# Altium schematic sheet ESC.SchDoc
size A2; SheetNumber: 1; SheetTotal: 1
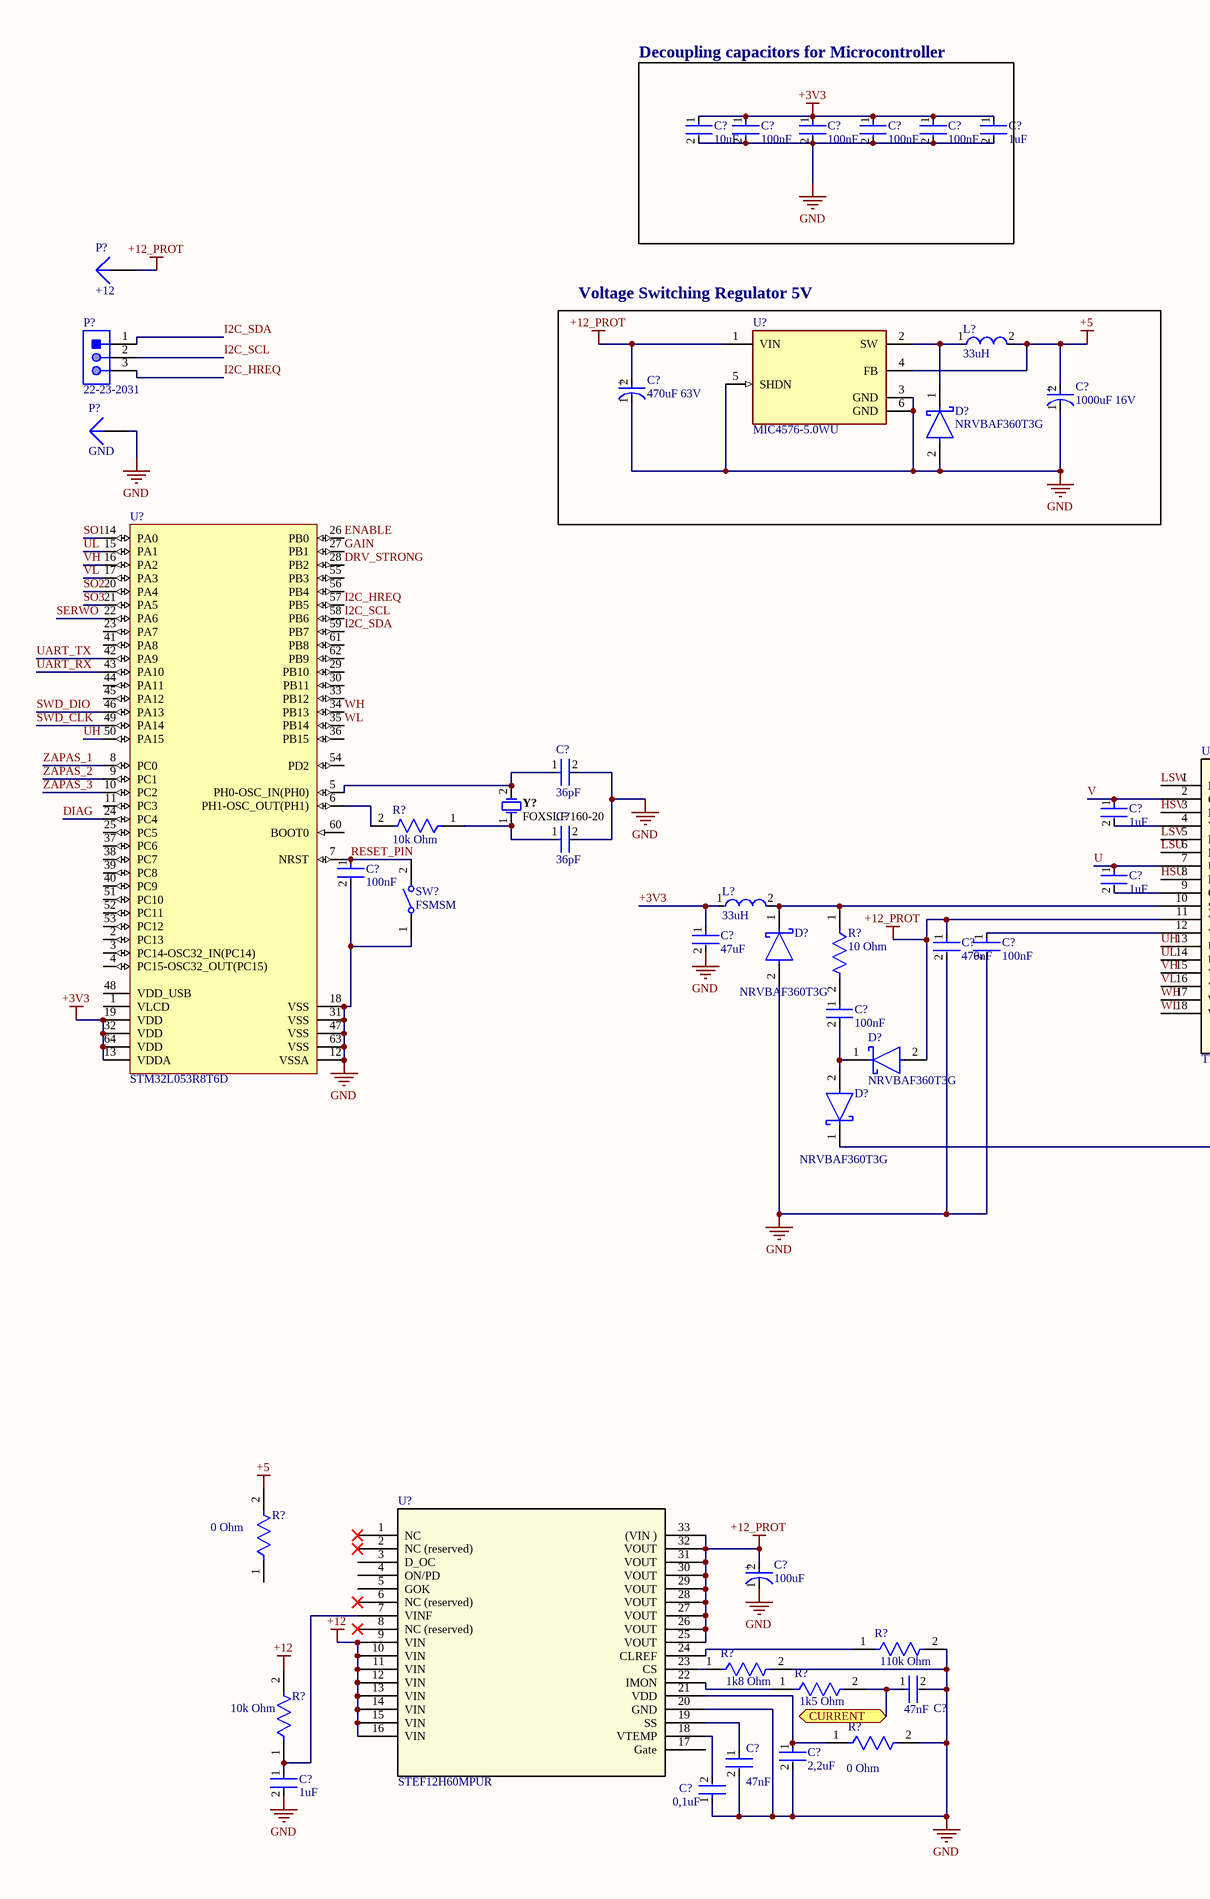
[diagram p0: ESC.SchDoc, left]
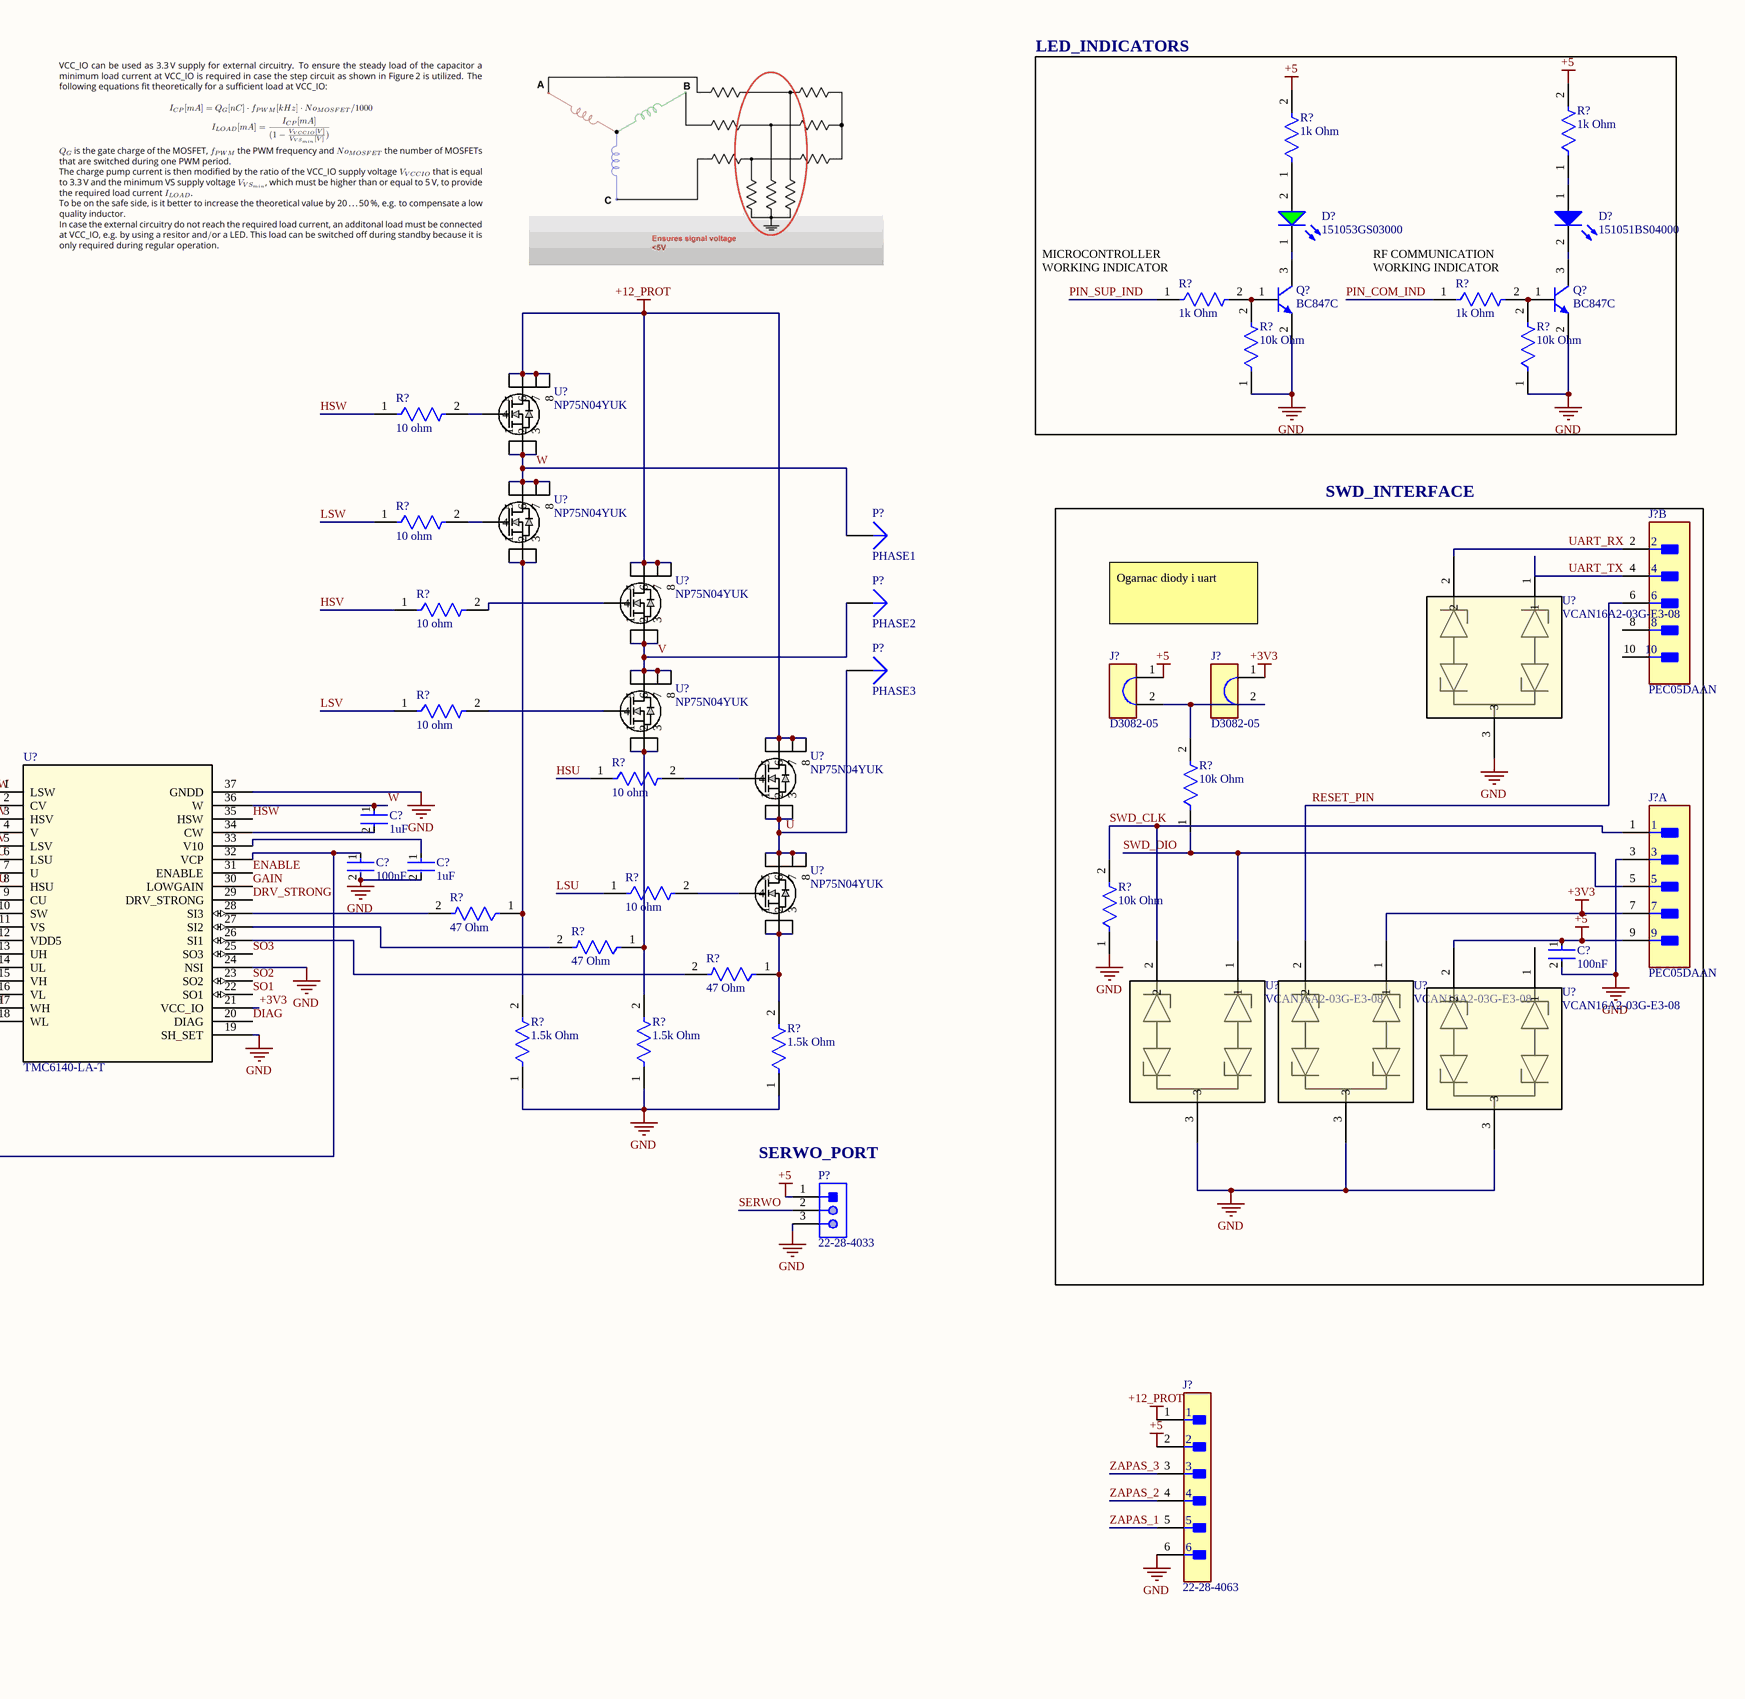
[diagram p1: ESC.SchDoc, right]

## Parts
(Parts that share a designator on the sheet are numbered #1, #2 ... from top to bottom, then left to right.)
C?#1  10uF  [FP-CC0805-0_85-MFG]
C?#2  100nF  [FP-CC0805-0_85-MFG]
C?#3  100nF  [FP-CC0805-0_85-MFG]
C?#4  100nF  [FP-CC0805-0_85-MFG]
C?#5  100nF  [FP-CC0805-0_85-MFG]
C?#6  1uF  [FP-CC0805-0_85-MFG]
C?#7  470uF 63V  [FP-FKJ16-MFG]
C?#8  1000uF 16V  [FP-OS-CON-SMT-F12-MFG]
C?#9  36pF  [FP-CC0805-0_85-MFG]
C?#10  1uF  [FP-CC0805-0_85-MFG]
C?#11  1uF  [FP-CC0805-0_85-MFG]
C?#12  36pF  [FP-CC0805-0_85-MFG]
C?#13  100nF  [FP-CC0805-0_85-MFG]
C?#14  1uF  [FP-CC0805-0_85-MFG]
C?#15  100nF  [FP-CC0805-0_85-MFG]
C?#16  1uF  [FP-CC0805-0_85-MFG]
C?#17  47uF  [FP-C3216-160-0_2-MFG]
C?#18  470nF  [FP-CC0805-0_85-MFG]
C?#19  100nF  [FP-CC0805-0_85-MFG]
C?#20  100nF  [FP-CC0805-0_85-MFG]
C?#21  100nF  [FP-CC0805-0_85-MFG]
C?#22  100uF  [FP-RAD-TH-D_10_0_5-L_12_5-MFG]
C?#23  47nF  [FP-CC0805-0_85-MFG]
C?#24  2,2uF  [FP-CC0805-0_85-MFG]
C?#25  47nF  [FP-CC0805-0_85-MFG]
C?#26  1uF  [FP-CC0805-0_85-MFG]
C?#27  0,1uF  [FP-CC0805-0_85-MFG]
D?#1  151053GS03000  [WL-TMRW_D5.8H11.7]
D?#2  151051BS04000  [WL-TMRC_D5.9H8.7]
D?#3  NRVBAF360T3G  [FP-403AA-01-MFG]
D?#4  NRVBAF360T3G  [FP-403AA-01-MFG]
D?#5  NRVBAF360T3G  [FP-403AA-01-MFG]
D?#6  NRVBAF360T3G  [FP-403AA-01-MFG]
J?#1  PEC05DAAN  [FP-PEC05DAAN-MFG]  (part B of 2)
J?#2  D3082-05  [FP-D3082-05-MFG]
J?#3  D3082-05  [FP-D3082-05-MFG]
J?#4  PEC05DAAN  [FP-PEC05DAAN-MFG]  (part A of 2)
J?#5  22-28-4063  [FP-22-28-4063-MFG]
L?#1  33uH  [FP-IHLP-4040DZ-FP_3_124x3-MFG]
L?#2  33uH  [FP-IHLP-4040DZ-FP_3_124x3-MFG]
P?#1  +12  [PIN1]
P?#2  22-23-2031  [MOLX-22-23-2031_V]
P?#3  GND  [PIN1]
P?#4  PHASE1  [PIN1]
P?#5  PHASE2  [PIN1]
P?#6  PHASE3  [PIN1]
P?#7  22-28-4033  [MOLX-22-28-4033_V]
Q?#1  BC847C  [INF-SOT23_L]
Q?#2  BC847C  [INF-SOT23_L]
R?#1  1k Ohm  [FP-RMCF0805-MFG]
R?#2  1k Ohm  [FP-RMCF0805-MFG]
R?#3  1k Ohm  [FP-RMCF0805-MFG]
R?#4  1k Ohm  [FP-RMCF0805-MFG]
R?#5  10k Ohm  [FP-RMCF0805-MFG]
R?#6  10k Ohm  [FP-RMCF0805-MFG]
R?#7  10 ohm  [FP-3522-MFG]
R?#8  10 ohm  [FP-3522-MFG]
R?#9  10 ohm  [FP-3522-MFG]
R?#10  10 ohm  [FP-3522-MFG]
R?#11  10 ohm  [FP-3522-MFG]
R?#12  10k Ohm  [FP-RMCF0805-MFG]
R?#13  10k Ohm  [FP-RMCF0805-MFG]
R?#14  10 ohm  [FP-3522-MFG]
R?#15  10 Ohm  [FP-RMCF0805-MFG]
R?#16  47 Ohm  [FP-RMCF0805-MFG]
R?#17  47 Ohm  [FP-RMCF0805-MFG]
R?#18  10k Ohm  [FP-RMCF0805-MFG]
R?#19  47 Ohm  [FP-RMCF0805-MFG]
R?#20  1.5k Ohm  [FP-RMCF0805-MFG]
R?#21  1.5k Ohm  [FP-RMCF0805-MFG]
R?#22  1.5k Ohm  [FP-RMCF0805-MFG]
R?#23  0 Ohm  [FP-RMCF0805-MFG]
R?#24  110k Ohm  [FP-RMCF0805-MFG]
R?#25  1k8 Ohm  [FP-RMCF0805-MFG]
R?#26  1k5 Ohm  [FP-RMCF0805-MFG]
R?#27  0 Ohm  [FP-RMCF0805-MFG]
R?#28  10k Ohm  [FP-RMCF0805-MFG]
SW?  FSMSM  [TECO-FSMSM-2_V]
U?#1  MIC4576-5.0WU  [FP-TO263-5LD-PL-1-MFG]
U?#2  NP75N04YUK  [WPAK_3_REN]
U?#3  NP75N04YUK  [WPAK_3_REN]
U?#4  STM32L053R8T6D  [STM-LQFP64_L]
U?#5  VCAN16A2-03G-E3-08  [SOT_3G-E3-08_VIS]
U?#6  NP75N04YUK  [WPAK_3_REN]
U?#7  NP75N04YUK  [WPAK_3_REN]
U?#8  NP75N04YUK  [WPAK_3_REN]
U?#9  TMC6140-LA-T  [QFN_140-LA_TRI]
U?#10  NP75N04YUK  [WPAK_3_REN]
U?#11  VCAN16A2-03G-E3-08  [SOT_3G-E3-08_VIS]
U?#12  VCAN16A2-03G-E3-08  [SOT_3G-E3-08_VIS]
U?#13  VCAN16A2-03G-E3-08  [SOT_3G-E3-08_VIS]
U?#14  STEF12H60MPUR  [QFN_60MPUR_STM]
Y?  FOXSLF/160-20  [FOX-FOXSLF160-20]

## Blocks framed on the sheet
Decoupling capacitors for Microcontroller: C?#1-C?#6
LED_INDICATORS: D?#1 D?#2 Q?#1 Q?#2 R?#1-R?#6
Voltage Switching Regulator 5V: C?#7 C?#8 D?#3 L?#1 U?#1
SWD_INTERFACE: C?#20 J?#1-J?#4 R?#13 R?#18 U?#5 U?#11-U?#13

## Ports
CURRENT (bidir)

## Nets
+3V3: C?#1.1 C?#2.1 C?#3.1 C?#4.1 C?#5.1 C?#6.1 C?#17.1 J?#3.1 J?#4.7 L?#2.1 U?#4.13(VDDA) U?#4.19(VDD) U?#4.32(VDD) U?#4.64(VDD) U?#9.21(VCC_IO) U?#12.1
+5: C?#8.2(A) C?#20.1 J?#2.1 J?#4.9 J?#5.2 L?#1.2 P?#7.1 R?#1.2 R?#2.2 R?#23.2 U?#1.4(FB) U?#13.2
+12: R?#28.2 U?#14.9(VIN) U?#14.10(VIN) U?#14.11(VIN) U?#14.12(VIN) U?#14.13(VIN) U?#14.14(VIN) U?#14.15(VIN) U?#14.16(VIN)
+12_PROT: C?#7.2(A) C?#18.1 C?#22.2(A) D?#5.2(A) J?#5.1 P?#1.1 U?#1.1(VIN) U?#2.5 U?#2.6 U?#2.7 U?#2.8 U?#6.5 U?#6.6 U?#6.7 U?#6.8 U?#8.5 U?#8.6 U?#8.7 U?#8.8 U?#9.11(VS) U?#14.25(VOUT) U?#14.26(VOUT) U?#14.27(VOUT) U?#14.28(VOUT) U?#14.29(VOUT) U?#14.30(VOUT) U?#14.31(VOUT) U?#14.32(VOUT) U?#14.33((VIN_))
GND: C?#1.2 C?#2.2 C?#3.2 C?#4.2 C?#5.2 C?#6.2 C?#7.1(C) C?#8.1(C) C?#9.2 C?#12.2 C?#13.2 C?#14.2 C?#15.2 C?#17.2 C?#18.2 C?#19.2 C?#20.2 C?#22.1(C) C?#23.2 C?#24.2 C?#25.2 C?#26.2 C?#27.1 D?#3.2(A) D?#4.2(A) J?#4.3 J?#5.6 P?#3.1 P?#7.3 Q?#1.2(E) Q?#2.2(E) R?#5.1 R?#6.1 R?#18.1 R?#20.1 R?#21.1 R?#22.1 R?#24.2 R?#25.2 R?#27.2 SW?.1 U?#1.3(GND) U?#1.5(SHDN) U?#1.6(GND) U?#4.12(VSSA) U?#4.18(VSS) U?#4.31(VSS) U?#4.47(VSS) U?#4.63(VSS) U?#5.3 U?#9.19(SH_SET) U?#9.24(NSI) U?#9.37(GNDD) U?#11.3 U?#12.3 U?#13.3 U?#14.20(GND)
CURRENT: C?#23.1 R?#26.2 ; port CURRENT
DIAG: U?#4.24(PC4) U?#9.20(DIAG)
DRV_STRONG: U?#4.28(PB2) U?#9.29(DRV_STRONG)
ENABLE: U?#4.26(PB0) U?#9.31(ENABLE)
GAIN: U?#4.27(PB1) U?#9.30(LOWGAIN)
HSU: R?#11.1 U?#9.8(HSU)
HSV: R?#9.1 U?#9.3(HSV)
HSW: R?#7.1 U?#9.35(HSW)
I2C_HREQ: P?#2.3 U?#4.57(PB5)
I2C_SCL: P?#2.2 U?#4.58(PB6)
I2C_SDA: P?#2.1 U?#4.59(PB7)
LSU: R?#14.1 U?#9.6(LSU)
LSV: R?#10.1 U?#9.5(LSV)
LSW: R?#8.1 U?#9.1(LSW)
PIN_COM_IND: R?#4.1
PIN_SUP_IND: R?#3.1
RESET_PIN: C?#15.1 J?#1.6 SW?.2 U?#4.7(NRST) U?#12.2
SERWO: P?#7.2 U?#4.22(PA6)
SO1: U?#4.14(PA0) U?#9.22(SO1)
SO2: U?#4.20(PA4) U?#9.23(SO2)
SO3: U?#4.21(PA5) U?#9.25(SO3)
SWD_CLK: J?#4.1 R?#18.2 U?#4.49(PA14) U?#11.2
SWD_DIO: J?#4.5 R?#13.1 U?#4.46(PA13) U?#11.1
U: C?#16.1 P?#6.1 U?#8.1 U?#8.2 U?#8.3 U?#9.7(U) U?#10.5 U?#10.6 U?#10.7 U?#10.8
UART_RX: J?#1.2 U?#4.43(PA10) U?#5.2
UART_TX: J?#1.4 U?#4.42(PA9) U?#5.1
UH: U?#4.50(PA15) U?#9.13(UH)
UL: U?#4.15(PA1) U?#9.14(UL)
V: C?#10.1 P?#5.1 U?#6.1 U?#6.2 U?#6.3 U?#7.5 U?#7.6 U?#7.7 U?#7.8 U?#9.2(CV)
VH: U?#4.16(PA2) U?#9.15(VH)
VL: U?#4.17(PA3) U?#9.16(VL)
W: C?#11.1 P?#4.1 U?#2.1 U?#2.2 U?#2.3 U?#3.5 U?#3.6 U?#3.7 U?#3.8 U?#9.36(W)
WH: U?#4.34(PB13) U?#9.17(WH)
WL: U?#4.35(PB14) U?#9.18(WL)
ZAPAS_1: J?#5.5 U?#4.8(PC0)
ZAPAS_2: J?#5.4 U?#4.9(PC1)
ZAPAS_3: J?#5.3 U?#4.10(PC2)
NetC?#9_1: C?#9.1 U?#4.5(PH0-OSC_IN(PH0)) Y?.2
NetC?#10_2: C?#10.2 U?#9.4(V)
NetC?#11_2: C?#11.2 U?#9.34(CW)
NetC?#12_1: C?#12.1 R?#12.1 Y?.1
NetC?#13_1: C?#13.1 D?#6.1(C) U?#9.32(VCP)
NetC?#14_1: C?#14.1 U?#9.33(V10)
NetC?#16_2: C?#16.2 U?#9.9(CU)
NetC?#19_1: C?#19.1 U?#9.12(VDD5)
NetC?#21_1: C?#21.1 R?#15.2
NetC?#21_2: C?#21.2 D?#5.1(C) D?#6.2(A)
NetC?#24_1: C?#24.1 R?#27.1 U?#14.21(VDD)
NetC?#25_1: C?#25.1 U?#14.19(SS)
NetC?#26_1: C?#26.1 R?#28.1 U?#14.7(VINF)
NetC?#27_2: C?#27.2 U?#14.18(VTEMP)
NetD?#1_1: D?#1.1(K) Q?#1.3(C)
NetD?#1_2: D?#1.2(A) R?#2.1
NetD?#2_1: D?#2.1(A) R?#1.1
NetD?#2_2: D?#2.2(K) Q?#2.3(C)
NetD?#3_1: D?#3.1(C) L?#1.1 U?#1.2(SW)
NetD?#4_1: D?#4.1(C) L?#2.2 R?#15.1 U?#9.10(SW)
NetJ?#2_2: J?#2.2 J?#3.2 R?#13.2
NetQ?#1_1: Q?#1.1(B) R?#3.2 R?#5.2
NetQ?#2_1: Q?#2.1(B) R?#4.2 R?#6.2
NetR?#7_2: R?#7.2 U?#2.4
NetR?#8_2: R?#8.2 U?#3.4
NetR?#9_2: R?#9.2 U?#6.4
NetR?#10_2: R?#10.2 U?#7.4
NetR?#11_2: R?#11.2 U?#8.4
NetR?#12_2: R?#12.2 U?#4.6(PH1-OSC_OUT(PH1))
NetR?#14_2: R?#14.2 U?#10.4
NetR?#16_1: R?#16.1 R?#20.2 U?#3.1 U?#3.2 U?#3.3
NetR?#16_2: R?#16.2 U?#9.28(SI3)
NetR?#17_1: R?#17.1 R?#21.2 U?#7.1 U?#7.2 U?#7.3
NetR?#17_2: R?#17.2 U?#9.27(SI2)
NetR?#19_1: R?#19.1 R?#22.2 U?#10.1 U?#10.2 U?#10.3
NetR?#19_2: R?#19.2 U?#9.26(SI1)
NetR?#24_1: R?#24.1 U?#14.24(CLREF)
NetR?#25_1: R?#25.1 U?#14.23(CS)
NetR?#26_1: R?#26.1 U?#14.22(IMON)

Not connected (* = marked no-connect by the designer): J?#1 8 10; R?#23 1; U?#4 1(VLCD) 2(PC13) 3(PC14-OSC32_IN(PC14)) 4(PC15-OSC32_OUT(PC15)) 11(PC3) 23(PA7) 25(PC5) 29(PB10) 30(PB11) 33(PB12) 36(PB15) 37(PC6) 38(PC7) 39(PC8) 40(PC9) 41(PA8) 44(PA11) 45(PA12) 48(VDD_USB) 51(PC10) 52(PC11) 53(PC12) 54(PD2) 55(PB3) 56(PB4) 60(BOOT0) 61(PB8) 62(PB9); U?#13 1; U?#14 1(NC)* 2(NC_(reserved))* 3(D_OC) 4(ON/PD) 5(GOK) 6(NC_(reserved))* 8(NC_(reserved))* 17(Gate)

## Notes on the sheet
- (near R?#3) MICROCONTROLLER WORKING INDICATOR
- (near R?#4) RF COMMUNICATION WORKING INDICATOR
- Ogarnac diody i uart
- (near P?#7) SERWO_PORT
- (in symbol CMP-05427-000075-2) +
- (in symbol CMP-05427-001012-1) +
- (in symbol CMP-05427-002168-1) +

## Library data of the parts
C?#1 C?#6 C?#9-C?#12 C?#14 C?#16 C?#18 C?#23-C?#27 = CMP-2100-03606-3: CAP CER 0.1UF 50V X7R 0805; Manufacturer Part Number: CC0805KRX7R9BB104; Manufacturer: Yageo; Tolerance: 0.1; Capacitance: 100 nF; Value: 100 nF; Material: Ceramic; Device Class L1: Passive Components; ComponentLink2Description: Datasheet; Package: CC0805-0.85; Digikey Description: CAP CER 0.1UF 50V X7R 0805; Device Class L3: Ceramic Capacitors; Temperature: -30°C to +85°C; Temperature Characteristic: X7R; Voltage Rating: 50 V; Height: 0.95mm; RoHS: TRUE; Ipc Land Pattern Name: CAPC200125X85; Device Class L2: Capacitors; Category: Cap; Temperature Range Low: -30°C; Temperature Range High: +85°C; Mouser Description: Multilayer Ceramic Capacitors MLCC - SMD/SMT 100nF 50V X7R 10%; Footprint Url: http://www.yageo.com/exep/pages/download/literatures/UPY-C_GEN_24.pdf; Automotive: No; Octopart: https://octopart.com/cc0805krx7r9bb104-yageo-192993; Lead Free: Yes; ComponentLink2URL: http://www.yageo.com/documents/recent/UPY-GPHC_Y5V_6.3V-to-50V_8.pdf
C?#2-C?#5 C?#13 C?#15 C?#19-C?#21 = CMP-2100-03606-3: CAP CER 0.1UF 50V X7R 0805; Manufacturer Part Number: CC0805KRX7R9BB104; Manufacturer: Yageo; Tolerance: 0.1; Material: Ceramic; Device Class L1: Passive Components; ComponentLink2Description: Datasheet; Package: CC0805-0.85; Digikey Description: CAP CER 0.1UF 50V X7R 0805; Capacitance: 100 nF; Device Class L3: Ceramic Capacitors; Value: 100 nF; Temperature: -30°C to +85°C; Temperature Characteristic: X7R; Voltage Rating: 50 V; Height: 0.95mm; RoHS: TRUE; Ipc Land Pattern Name: CAPC200125X85; Device Class L2: Capacitors; Category: Cap; Temperature Range Low: -30°C; Temperature Range High: +85°C; Mouser Description: Multilayer Ceramic Capacitors MLCC - SMD/SMT 100nF 50V X7R 10%; Footprint Url: http://www.yageo.com/exep/pages/download/literatures/UPY-C_GEN_24.pdf; Automotive: No; Octopart: https://octopart.com/cc0805krx7r9bb104-yageo-192993; Lead Free: Yes; ComponentLink2URL: http://www.yageo.com/documents/recent/UPY-GPHC_Y5V_6.3V-to-50V_8.pdf
C?#7 = CMP-05427-002168-1: CAP ALUM 470UF 20% 63V SMD; Dissipation Factor: 0.1%; ESR (Equivalent Series Resistance): 82mR; Life (Hours): 5000Hour; Ripple Current (AC): 1.41A; Height: 16.5mm; Packaging: Tape and Reel; Length: 16.5mm; RoHS Compliant: Yes; Construction: Cylindrical; Mount: Surface Mount; Radiation Hardening: No; Impedance: 82mR; Min Operating Temperature: -55°C; Max Operating Temperature: 105°C; Reach SVHC Compliant: Yes; Lead Pitch: 6.7mm; Voltage: 63V; Series: FK; Lead Free: Lead Free; Height - Seated (Max): 0.65inch; Case/Package: Radial; Voltage Rating: 63V; Package Quantity: 125; Tolerance: 20%; Ratings: AEC-Q200; Voltage Rating (DC): 63V; Diameter: 16mm; Capacitance: 470uF; Ripple Current: 1.41A; Termination: SMD/SMT
C?#8 = CMP-05427-000075-2: Conductive Polymer Aluminum Solid Capacitors (OS-CON) 1000uF ±20% 16V RADIAL SMT 10x12.6mm; Dissipation Factor: 12%; Ripple Current: 5.4A; ESR (Equivalent Series Resistance): 12mR; Life (Hours): 5000Hour; Capacitance: 1mF; Polarity: Polar; Leakage Current: 3.2mA; Diameter: 10mm; Height: 12.6mm; Case/Package: Radial; Voltage Rating (DC): 16V; Length: 12.6mm; Voltage: 16V; Packaging: Tape and Reel; Termination: SMD/SMT; Voltage Rating: 16V; Package Quantity: 1; Radiation Hardening: No; Ripple Current (AC): 5.4A; Lead Free: Lead Free; REACH SVHC: No SVHC; Construction: Cylindrical; Height - Seated (Max): 0.5inch; Series: OS-CON, SVPF; Mount: Surface Mount; Number of Pins: 12; Min Operating Temperature: -55°C; Tolerance: 20%; Max Operating Temperature: 105°C; RoHS Compliant: Yes
C?#17 = CMP-2000-05397-3: Multilayer Ceramic Capacitors 47uF ±20% 25V X5R SMD 1206; Weight: 0.000571oz; Dielectric: X5R; Length: 0.126inch; Voltage Rating: 25V; Case/Package: 1206; Dielectric Material: Ceramic; Min Operating Temperature: -55°C; Lead Free: Lead Free; Packaging: Tape and Reel; Package Quantity: 1; Mount: Surface Mount; Depth: 1.6mm; REACH SVHC: No SVHC; Termination: SMD/SMT; Case Code (Imperial): 1206; Series: C; Resistor Type: Ceramic; Voltage: 25V; Width: 0.063inch; Height: 1.6mm; Tolerance: 20%; Capacitance: 47uF; Max Operating Temperature: 85°C; Voltage Rating (DC): 25V; RoHS Compliant: Yes; Thickness: 0.071inch; Case Code (Metric): 3216
C?#22 = CMP-05427-001012-1: Aluminum Electrolytic Capacitors (Radial Lead Type) 3.3uF ±20% 400V; Dielectric Material: Aluminium; Ripple Current (AC): 40mA; Lead/Base Style: Straight; Life (Hours): 2000Hour; Lead Diameter: 0.6mm; Polarity: Polar; Voltage Rating (DC): 400V; Max Operating Temperature: 105°C; Lead Pitch: 5mm; Termination: Radial; Lead Free: Lead Free; Radiation Hardening: No; Voltage Rating: 400V; Tolerance: 20%; Construction: RADIAL; Ripple Current: 40mA; Min Operating Temperature: -25°C; Diameter: 10mm; Contact Plating: Tin; Package Quantity: 200; Mount: Through Hole; REACH SVHC: No SVHC; Height: 12.5mm; Case/Package: Radial; Height - Seated (Max): 0.531inch; RoHS Compliant: Yes; Series: NHG; Capacitance: 3.3uF; Packaging: Bulk; Number of Pins: 2; Voltage: 400V; Length: 12.5mm
D?#1 = CMP-1489-00005-2: NexarPartId: 29717817; Viewing Angle: 30°; Color: Green; Wavelength: 522nm; Max Reverse Voltage (DC): 5V; Test Current: 20mA; Forward Current: 100mA; Forward Voltage: 3.4V; Lens Style: Circular, Clear, Round; Luminous Intensity: 10cd; Lens Size: 5mm; Peak Wavelength: 515nm; Length: 5mm; Min Operating Temperature: -40°C; Case/Package: Radial; REACH SVHC: Unknown; Height: 8.6mm; Mount: Through Hole; Dominant Wavelength: 522nm; Max Operating Temperature: 85°C; Width: 5mm; Packaging: Bulk; RoHS: Compliant
D?#2 = CMP-1488-00009-2: NexarPartId: 29717812; Test Current: 20mA; Forward Voltage: 3.2V; Wavelength: 470nm; Lens Size: 5mm; Lens Style: Circular, Diffused, Round; Forward Current: 100mA; Peak Wavelength: 465nm; Viewing Angle: 40°; Luminous Intensity: 500mcd; Max Reverse Voltage (DC): 5V; Color: Blue; Case/Package: Radial; Width: 5mm; Mount: Through Hole; Min Operating Temperature: -40°C; Length: 5mm; Height: 8.6mm; Max Operating Temperature: 85°C; Packaging: Bulk; RoHS: Compliant; REACH SVHC: Unknown; Dominant Wavelength: 470nm
D?#3-D?#6 = CMP-00278-47358757-1: NRVBAF360T3G Rectifier Diode, Schottky, 1 Phase, 1 Element, 4A, 60V V(RRM), Silicon; Manufacturer Lifecycle Status: ACTIVE; Peak Reverse Current: 30µA; Forward Voltage: 630mV; Max Junction Temperature (Tj): 150°C; Max Forward Surge Current (Ifsm): 125A; Lifecycle Status: Production; Reverse Voltage: 60V; Max Operating Temperature: 150°C; Max Repetitive Reverse Voltage (Vrrm): 60V; Mount: Surface Mount; Schedule B: 8541100080; RoHS: Compliant; Packaging: Tape & Reel (TR); Average Rectified Current: 4A; Lead Free: Lead Free; Forward Current: 4A; Min Operating Temperature: -65°C; Max Reverse Voltage (DC): 60V; NexarPartId: 47358757; Case/Package: SMA; Height: 1.1mm
J?#1 J?#4 = CMP-25680-000034-1: CONN HEADER VERT 10POS 2.54MM; Pitch: 0.1inch; Number of Positions: 10; Gender: Male; Connector Type: Male Pin; Contact Type: Male Pin; Height: 2.54mm; Termination: Solder; Packaging: Bulk; Housing Material: Plastic; Contact Mating Length: 0.23inch; Width: 5.08mm; Row Spacing: 0.1inch; Housing Color: Black; Mount: Through Hole; Contact Plating: Tin; Contact Material: Bronze; Color: Black; Package Quantity: 1; Length: 12.7mm; Lead Free: Lead Free; Number of Rows: 2; Number of Contacts: 10
J?#2 J?#3 = CMP-15817-000014-1: 1MM UNINSULATED SHORTING PLUG; Number of Contacts: 2; Body Length: 9mm; Current Rating: 10A; Insulation: Non-Insulated; Plating: Gold; Pitch: 10.16mm; Gender: Male; Hole Diameter: 1.05mm; Length: 9mm; RoHS Compliant: Yes; Orientation: Straight; Number of Rows: 1; Package Quantity: 2000; Max Current Rating: 10A; Material: Brass; Insulation Material: PBT; Series: D308; Height: 0.359inch; Mount: Through Hole; Contact Material: Brass; Number of Positions: 2; Packaging: Bulk; REACH SVHC: No SVHC; Contact Plating: Gold; Depth: 1mm; Color: Black
J?#5 = CMP-04776-000885-1: CONN HEADER VERT 6POS 2.54MM; Number of Circuits: 6; Voltage Rating (DC): 250V; Connector Type: Male Pin; Contact Resistance: 20mR; Glow Wire Compliant: Non-compliant; Gender: Male; Current Rating: 4A; Max Voltage Rating (DC): 250.25kV; Series: KK® 42375; Termination: Solder; Orientation: Straight; Max Operating Temperature: 75°C; Min Operating Temperature: 0°C; Mount: Through Hole; Depth: 2.49mm; Contact Material: Brass; Number of Positions: 6; Contact Mating Length: 0.24inch; Number of Rows: 1; Housing Color: Black; Max Voltage Rating (AC): 250V; Housing Material: Thermoplastic; Packaging: Bulk; Contact Plating: Gold; Contact Type: Male Pin; Package Quantity: 1; Number of Contacts: 6; Voltage Rating: 250V; Lead Free: Lead Free; RoHS Compliant: Yes; Pitch: 2.54mm; Color: Black; Flammability Rating: UL94 V-0; Radiation Hardening: No
L?#1 L?#2 = CMP-02424-000211-1: Automotive Inductors, High Temperature (155 °C) Series 33uH 3.7A 117.7mΩ 20%; Test Frequency: 100kHz; DC Resistance (DCR): 117.7mR; Saturation Current: 4.2A; Shielding: Shielded; Lead Free: Lead Free; Width: 0.405inch; Package Quantity: 500; Current Rating: 3.7A; Tolerance: 20%; Min Operating Temperature: -55°C; Packaging: Tape and Reel; Max Operating Temperature: 125°C; Inductance: 33uH; Military Standard: Not; Case/Package: 4040; Depth: 10.3mm; Length: 0.425inch; Max DC Current: 4.2A; Height: 4mm; Termination: SMD/SMT; Mount: Surface Mount; Height - Seated (Max): 0.158inch
P?#1 P?#3-P?#6 = Plug: LatestRevisionDate: 17-Jul-2002; LatestRevisionNote: Re-released for DXP Platform.; Publisher: Altium Limited
P?#2 = CMP-2000-05242-1: Male Header, Pitch 2.54 mm, 1 x 3 Position, Height 8.18 mm, Tail Length 3.56 mm, RoHS, Bulk; Current Rating: 4A; Brand: Molex; Pitch: 2.54mm; Voltage Rating: 250V; Mounting Angle: Vertical; Type: Locking; Factory Pack Quantity: 16000; Tradename: KK; Housing Material: Nylon; Contact Material: Brass; Manufacturer URL: http://www.molex.com/; Termination Style: ThroughHole; Mounting Style: ThroughHole; Number of Positions: 3Position; Contact Gender: Pin(Male); Packaging: Bulk; Series: 6373; Datasheet Version: Sep-01; Contact Plating: Tin; Product: Headers; Datasheet URL: https://datasheet.ciiva.com/19472/232274-19472863.pdf; RoHS: Details; Product Category: Headers&WireHousings; Manufacturer: Molex; Number of Rows: 1Row
P?#7 = CMP-1676-00001-5: Male Header, Pitch 2.54 mm, 1 x 3 Position, Height 8.38 mm, Tail Length 3.18 mm, RoHS, Bulk; Manufacturer: Molex; Rows: 1; Voltage Rating: 250 V; Current Rating: 4 A; Min Operating Temperature: 0 degC; Lead Pitch: 0.1 inch; Packaging: Bulk; Contact Finish: Gold; RoHSCompliant: true; Contact Material: Brass; PackageReference: 22-28-4033; REACH SVHC: Unknown; PackageDescription: Male Header, Pitch 2.54 mm, 1 x 3 Position, Height 8.38 mm, Tail Length 3.18 mm; ComponentLink2URL: http://www.molex.com/pdm_docs/sd/022284033_sd.pdf; Height: 8.38 mm; Mounting Technology: Through Hole; ComponentLink1Description: Manufacturer URL; Length: 7.62 mm; Mount: Through Hole; DatasheetVersion: Rev. G, 01/2012; Max Operating Temperature: 75 degC; ComponentLink2Description: Datasheet; Colour: Black; Pins: 3; Contact Plating: Gold; Package Quantity: 1; ComponentLink1URL: http://www.molex.com/
Q?#1 Q?#2 = CMP-1177-00037-1: NPN Silicon AF Transistor, 45 V VCEO, 100 mA IC, SOT23, Reel, Green; Manufacturer: Infineon; VCEO (max): 45Â V; VEBO (max): 6Â V; fT (typ): 250Â MHz; VCBO (max): 50Â V; ICM (max): 200Â mA; Green: TRUE; IC (max): 100Â mA; Ptot (max): 330Â mW; ICBO (max): 15Â nA; PartNumber: BC847C; ComponentLink3URL: http://www.infineon.com/dgdl/SOT23-Package_Overview.pdf?folderId=db3a30431936bc4b0119532290053c66&fileId=db3a30431936bc4b0119533468123c85; ComponentLink3Description: Package Specification; Mounting Technology: Surface Mount; PackageDescription: 3-Pin Small Outline Transistor Package, 1.3 x 2.9 mm Body, 0.95 mm Pitch; PackageReference: SOT23; ComponentLink2URL: http://www.infineon.com/dgdl/bc847series_bc848series_bc849series_bc850series.pdf?folderId=db3a304314dca389011541d30fa21656&fileId=db3a304314dca389011541d4630a1657; ComponentLink2Description: Datasheet; ComponentLink1Description: Manufacturer URL; Polarity: NPN; ComponentLink1URL: http://www.infineon.com/; IBM (max): 200Â mA; Packing: Reel; PackageVersion: Apr-08
R?#1-R?#6 R?#12 R?#13 R?#15-R?#28 = CMP-26527-000017-1: RES 0 OHM JUMPER 1/8W 0805; Power Rating: 125mW; Resistance: 0mR; Depth: 1.25mm; Length: 2mm; Military Standard: Not; Width: 0.049inch; Case Code (Imperial): 0805; Number of Terminations: 2; Mount: Surface Mount; Contact Plating: Tin; Height: 0.026inch; Case/Package: 0805; Min Operating Temperature: -55°C; Composition: Thick Film; Max Operating Temperature: 155°C; Packaging: Tape and Reel; Features: Automotive AEC-Q200; Max Power Dissipation: 125mW; Radiation Hardening: No; Lead Free: Lead Free; Case Code (Metric): 2012
R?#7-R?#11 R?#14 = CMP-03790-73012700-1: 1-2176230-4 SMD Chip Resistor, 10 Ohm, ± 5%, 3 W, 2512 [6332 Metric], Thick Film, High Power; Manufacturer Lifecycle Status: ACTIVE; Voltage Rating (DC): 250V; Resistance: 10Ω; Power Rating: 3W; Temperature Coefficient: 400ppm/°C; Packaging: Cut Tape; Schedule B: 8533210045; Case/Package: 2512; Composition: Thick Film; Tolerance: 5%; Max Operating Temperature: 155°C; RoHS: Compliant; Voltage Rating: 250V; NexarPartId: 73012700; Lifecycle Status: Production; Min Operating Temperature: -55°C; Height: 1.2mm
SW? = CMP-2000-07511-1: FSMSM Push Button Switch, 50 mA, -35 to 85 degC, 2-Pin SMD, RoHS, Bulk; Manufacturer: TE Connectivity; Actuator Length: 1.07mm; Electrical Life: 20000Cycles; Actuator Material: Polyamide; Current Rating: 50mA; Illumination Type: Illuminated; Voltage Rating (DC): 24V; Contact Resistance: 100mOhm; Case\/Package: SMD/SMT; Operating Force: 180gf; Switch Travel: 0.25mm; Max Voltage Rating (DC): 12V; Throw Configuration: SPST; Packaging: LoosePiece; Max Operating Temperature: 85degC; ELV: Compliant; Package Description: 2-Pin Surface Mount Device, Body 6 x 3.5 mm, Pitch 9.19 mm; RoHSCompliant: true; Manufacturer URL: http://www.te.com/; Contact Plating: Silver; Contact Material: Brass; Mounting Technology: SurfaceMount; Contact Current Rating: 50mA; Datasheet Version: Rev. C2, 08/2014; Datasheet URL: http://www.te.com/commerce/DocumentDelivery/DDEController?Action=showdoc&DocId=Customer+Drawing%7F1437566-3%7FC2%7Fpdf%7FEnglish%7FENG_CD_1437566-3_C2_1437566_3_1_c.dwg.pdf%7F1437566-3; Mechanical Life: 20000Cycles; Package Reference: FSMSM; REACH SVHC: Unknown; Orientation: Straight; Min Operating Temperature: -35degC; Lead Free: LeadFree; Termination: GullWing; Package Quantity: 1000; Mount: SurfaceMount
U?#1 = CMP-00252-66526102-1: MIC4576-5.0WU MIC4576 Series 36 V 200 kHz 3 A Surface Mount Simple Buck Regulator - TO-263-5; Efficiency: 77%; Max Junction Temperature (Tj): 85°C; Output Voltage: 5V; Nominal Supply Current: 5mA; Output Current: 3A; Max Input Voltage: 36V; Min Input Voltage: 4V; Max Duty Cycle: 95%; Switching Frequency: 200kHz; Output Type: Fixed; Synchronous Rectifier: No; Number of Outputs: 1; Output Configuration: Positive; Max Operating Temperature: 85°C; Case/Package: TO-263-6; Lead Free: Lead Free; Length: 10.67mm; Width: 9.17mm; Min Operating Temperature: -40°C; Radiation Hardening: No; RoHS: Compliant; Packaging: Bulk; Lifecycle Status: Production; NexarPartId: 66526102; Min Supply Voltage: 4V; Number of Pins: 6; Schedule B: 8542390000; Min Output Voltage: 5V; Mount: Surface Mount; Max Supply Voltage: 36V; Max Output Current: 3A; Height: 4.59mm
U?#2 U?#3 U?#6-U?#8 U?#10 = RJK03M1DPA-00J5A: No Description Available; Mfr_Name: Renesas Electronics
U?#4 = CMP-1546-00063-2: Ultra-low-power 32-Bit MCU ARM-based Cortex-M0+, 64 KB Flash, 8 KB RAM, 51 I/Os, 64-Pin LQFP, -40 to 85 degC, Tray; I/Os (High Current): 51; Core: ARM Cortex-M0+; FLASH Size (Prog) (kB): 64; Internal RAM Size (kB): 8; D/A Converter: 1; Operating Frequency(F) (Processor speed) (MHz): 32; Supply Voltage(Vcc) min (V): 1.65; Data E2PROM nom (B): 2048; Package Description: 64-Pin Low-profile Quad Flat Package, Body 10 x 10 mm, Pitch 0.5 mm; ComponentLink2URL: http://www.st.com/st-web-ui/static/active/en/resource/technical/document/datasheet/DM00105960.pdf; Package Reference: LQFP64; ComponentLink1URL: http://www.st.com/; Packing: Tray; ComponentLink1Description: Manufacturer URL; ComponentLink2Description: Datasheet; DatasheetVersion: Rev. 5; Mounting Technology: Surface Mount
U?#5 U?#11-U?#13 = VCAN16A2-03G-E3-08: No Description Available; Mfr_Name: Vishay; RefDes: RefDes; Type: Type
U?#9 = TMC6140-LA-T: No Description Available; Mfr_Name: Analog Devices / Trinamic; RefDes: RefDes; Type: Type
U?#14 = STEF12H60MPUR: No Description Available; Mfr_Name: STMicroelectronics; RefDes: RefDes; Type: Type
Y? = CMP-1749-00003-1: Resistance Weld Thru-Hole Crystal, 16 MHz, -20 to 70 degC, 2-Pin THD, RoHS, Bulk; Voltage Rating: 250 V; Tolerance: 1%; Resistance: 221 kohm; Case\Package: Axial; Power Rating: 250 mW; RoHSCompliant: true; Package Quantity: 200; Packaging: Bulk; Min Operating Temperature: -55 degC; DatasheetVersion: Mar-15; ComponentLink1URL: http://www.foxonline.com/; Max Operating Temperature: 155 degC; PackageReference: FOXSLF160-20; Mount: Through Hole; PackageDescription: 2-Pin Through Hole Device, Body 11.35 x 4.65 mm; ComponentLink1Description: Manufacturer URL; ComponentLink2URL: http://www.foxonline.com/pdfs/hc49slf.pdf; ComponentLink2Description: Datasheet; Length: 0.248 inch